# EAGLE design Fablab_RFID_conroller_V1 (EAGLE 7.5.0)
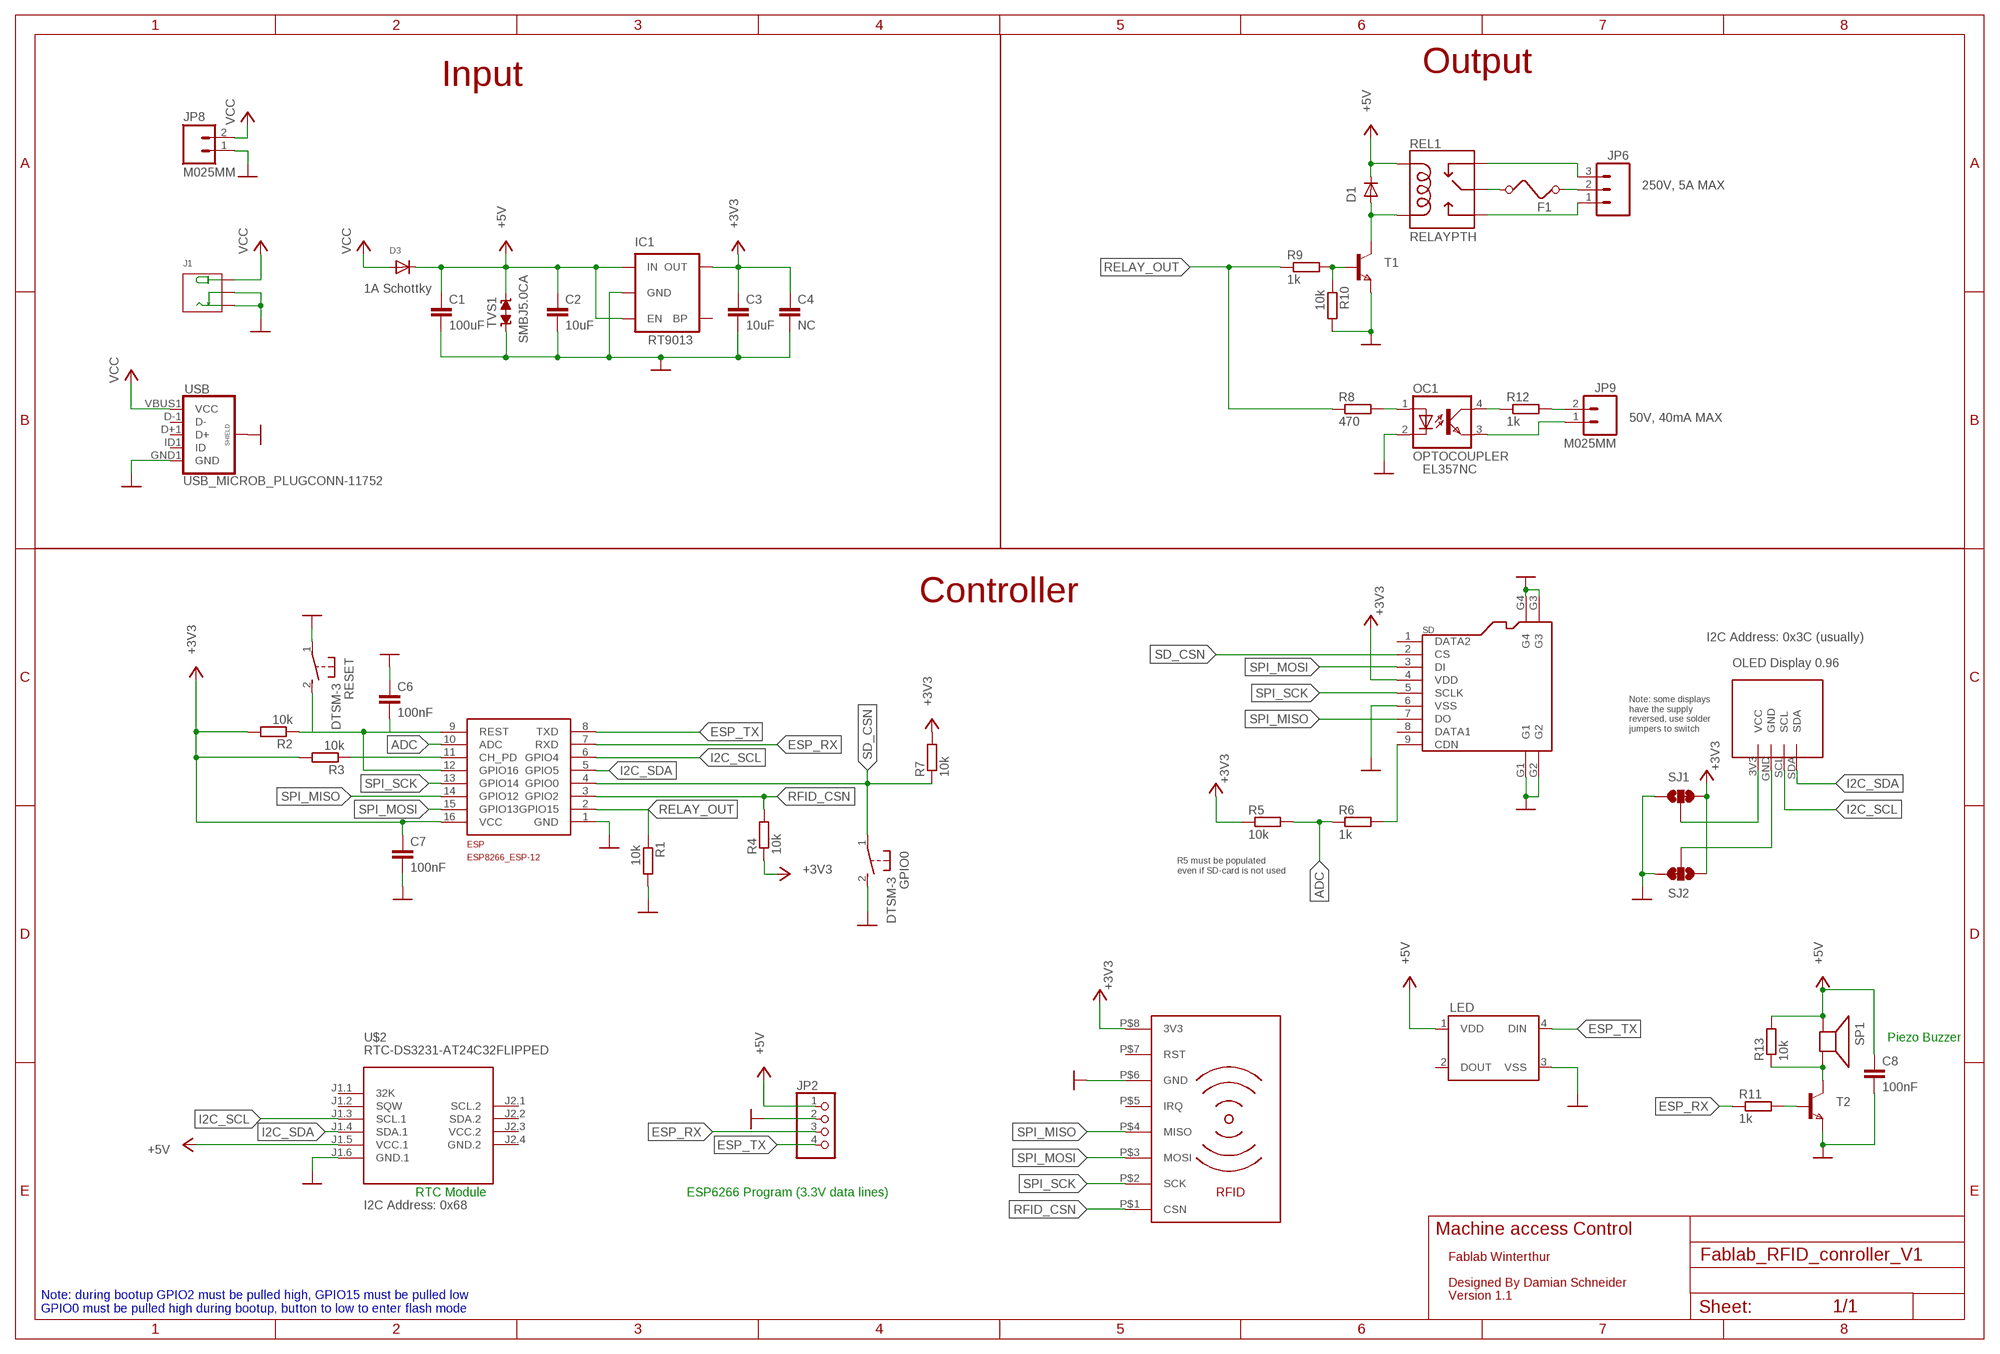
[diagram p0: schematic, sheet 1]

## Parts
C1  100uF  C-EUC1206  [C1206]
C2  10uF  C-EUC0805  [C0805]
C3  10uF  C-EUC0805  [C0805]
C4  NC  C-EUC1206  [C1206]
C6  100nF  C-EUC0603  [C0603]
C7  100nF  C-EUC0603  [C0603]
C8  100nF  C-EUC0603  [C0603]
D1  DIODE-MINIMELF  [MINIMELF]
D3  DIODESMA  [SMADIODE]
ESP  ESP8266_ESP-12  [ESP8266-ESP12]
F1  FUSE  [FUSE]
GPIO0  DTSM-3  [DTSM-3]
IC1  V_REG_LDOSMD  [SOT23-5]
J1  JACK-DC-3P-3410020P1  [PW-3P-2.1]
JP2  HEADER-1X476MIL  [1X04_ROUND_76]
JP6  M03-SCREW-5MM  [SCREWTERMINAL-5MM-3]
JP8  M025MM  [SCREWTERMINAL-5MM-2]
JP9  M025MM  [SCREWTERMINAL-5MM-2]
LED  WS2812B  [WS2812B]
OC1  OPTOCOUPLER  [SOP04]
OLED  OLED_0.96_I2CNOHOLES  [OLED_0.96_I2C_NOHOLES]
R1  10k  R-EU_R0603  [R0603]
R2  10k  R-EU_R0603  [R0603]
R3  10k  R-EU_R0603  [R0603]
R4  10k  R-EU_R0603  [R0603]
R5  10k  R-EU_R0603  [R0603]
R6  1k  R-EU_R0603  [R0603]
R7  10k  R-EU_R0603  [R0603]
R8  470  R-EU_R0603  [R0603]
R9  1k  R-EU_R0603  [R0603]
R10  10k  R-EU_R0603  [R0603]
R11  1k  R-EU_R0603  [R0603]
R12  1k  R-EU_R0805  [R0805]
R13  10k  R-EU_R0603  [R0603]
REL1  RELAYPTH  [SRD-05VDC-SL-C]
RESET  DTSM-3  [DTSM-3]
RFID  RFID_MODULE_RC522  [RFID-RC522-MODULE]
SD  MICRO-SDCARD-CONNECTOR-3300060P1  [9P-SMD-W-RING]
SJ1  JUMPER-PAD-3-2OF3_NC_BY_TRACE_LARGE  [PAD-JUMPER-3-2OF3_NC_BY_TRACE_YES_SILK_LARGE]
SJ2  JUMPER-PAD-3-2OF3_NC_BY_TRACE_LARGE  [PAD-JUMPER-3-2OF3_NC_BY_TRACE_YES_SILK_LARGE]
SP1  SPEAKER/AL60P  [AL60P]
T1  NPNSOT23  [SOT-23]
T2  NPNSOT23  [SOT-23]
TVS1  TVS-SMBJ  [SMBJ]
U$2  RTC-DS3231-AT24C32FLIPPED  [RTC-DS3231_FLIPPED]
USB  USB_MICROB_PLUGCONN-11752  [USB-B-MICRO-SMD_V03]

## Nets
!SDCARD_DETECT: R6.2 SD.9(CDN)
+3V3: C3.1 C4.1 C7.1 ESP.16(VCC) IC1.5(OUT) R2.2 R3.2 R4.1 R5.1 R7.2 RFID.P$8(3V3) SD.4(VDD) SJ1.3 SJ2.1
+5V: C1.1 C2.1 C8.1 D1.C D3.C IC1.1(IN) IC1.3(EN) JP2.1 LED.1(VDD) R13.2 REL1.COIL1 SP1.1(+) TVS1.C U$2.J1.5(VCC.1)
ADC: ESP.10(ADC) R5.2 R6.1
CHPD: ESP.11(CH_PD) R3.1
ESP_RX: ESP.7(RXD) JP2.3 R11.1
ESP_TX: ESP.8(TXD) JP2.4 LED.4(DIN)
GND: C1.2 C2.2 C3.2 C4.2 C6.1 C7.2 C8.2 ESP.1(GND) GPIO0.2 IC1.2(GND) J1.-1(-) J1.-2(CDN) JP2.2 JP8.1 LED.3(VSS) OC1.2(C) R1.2 R10.2 RESET.1 RFID.P$6(GND) SD.6(VSS) SD.G1 SD.G2 SD.G3 SD.G4 SJ1.1 SJ2.3 T1.2(E) T2.2(E) TVS1.A U$2.J1.6(GND.1) USB.GND1(GND) USB.SHIELD1(SHIELD) USB.SHIELD2(SHIELD) USB.SHIELD3(SHIELD)
I2C_SCL: ESP.6(GPIO4) OLED.SCL U$2.J1.3(SCL.1)
I2C_SDA: ESP.5(GPIO5) OLED.SDA U$2.J1.4(SDA.1)
N$1: JP9.2 R12.2
N$2: OLED.3V3(VCC) SJ1.2
N$3: OLED.GND SJ2.2
N$4: R9.2 R10.1 T1.3(B)
N$6: D1.A REL1.COIL0 T1.1(C)
N$8: R13.1 SP1.2(-) T2.1(C)
N$11: R11.2 T2.3(B)
N$12: F1.1 JP6.2
N$13: JP6.1 REL1.SW_NO(SWOPEN)
N$14: F1.2 REL1.SWCOMMON
N$15: JP6.3 REL1.SW_NC(SWCLOSE)
N$16: OC1.1(A) R8.2
N$17: OC1.4(COL) R12.1
N$18: JP9.1 OC1.3(EMIT)
RELAY_OUT: ESP.2(GPIO15) R1.1 R8.1 R9.1
RESET: C6.2 ESP.9(REST) ESP.12(GPIO16) R2.1 RESET.2
RFID_CSN: ESP.3(GPIO2) R4.2 RFID.P$1(CSN)
SD_CSN: ESP.4(GPIO0) GPIO0.1 R7.1 SD.2(CS)
SPI_MISO: ESP.14(GPIO12) RFID.P$4(MISO) SD.7(DO)
SPI_MOSI: ESP.15(GPIO13) RFID.P$3(MOSI) SD.3(DI)
SPI_SCK: ESP.13(GPIO14) RFID.P$2(SCK) SD.5(SCLK)
VCC: D3.A J1.+ JP8.2 USB.VBUS1(VCC)
Unconnected: IC1.4(BP) LED.2(DOUT) RFID.P$5(IRQ) RFID.P$7(RST) SD.1(DATA2) SD.8(DATA1) U$2.J1.1(32K) U$2.J1.2(SQW) U$2.J2.1(SCL.2) U$2.J2.2(SDA.2) USB.D+1(D+) USB.D-1(D-) USB.ID1(ID)

## Notes on the sheet
- Output
- Input
- 250V, 5A MAX
- 1A Schottky
- SMBJ5.0CA | RT9013
- 50V, 40mA MAX
- EL357NC
- Controller
- I2C Address: 0x3C (usually)
- OLED Display 0.96
- Note: some displays 
  have the supply 
  reversed, use solder
  jumpers to switch
- R5 must be populated
  even if SD-card is not used
- Piezo Buzzer
- RTC Module | ESP6266 Program (3.3V data lines)
- I2C Address: 0x68
- Machine access Control
- Fablab Winterthur
- Designed By Damian Schneider
- Version 1.1
- Note: during bootup GPIO2 must be pulled high, GPIO15 must be pulled low
  GPIO0 must be pulled high during bootup, button to low to enter flash mode

## Power pins joined to a net without a drawn wire
GND.2: U$2.J2.4(GND.2)
VCC.2: U$2.J2.3(VCC.2)

## Library data of the parts
C1-C4 C6-C8 = resistor:C-EU: CAPACITOR, European symbol
D1 = diode:DIODE-: DIODE
D3 = adafruit:DIODE: Diode SMADIODE - SMA Surface Mount Package 20V 1A Schottky Diode Digikey: 641-1014-6-ND DO-1N4148 - Through Hole Small Current Diode SOD-123 20V 1 A (.5mV Vf) Schottky Diode - Digikey: MBRX120TPMSCT-ND SOD-323 10V 570mA (.38mV Vf, 3ns) Schottky Diode - Digikey: ZLLS410CT-ND SOD-523 30V 30mA Schottky Diode (RB751S-40TE61) - Digikey: RB751S-40TE61CT-ND SOT23-R/W - SOT23 Package (R = Solder Paste/Reflow Ovens, W = Hand-Soldering) BAT54Film 40V 300mA - Digikey: 497-7162-1-ND
ESP = ESP8266-ESP12:ESP8266_ESP-12
F1 = special:FUSE: FUSE 5 x 20 mm
GPIO0 RESET = switch-mini-chinese-tact:DTSM-3
IC1 = SparkFun-PowerIC:V_REG_LDO: Voltage Regulator LDO Standard 150mA LDO voltage regulator in SOT-23 layout. Micrel part MIC5205. BP (by-pass) pin is used to lower output noise with 470pF cap.
J1 = OPL Eagle Library:JACK-DC-3P
JP2 = microbuilder:HEADER-1X4: PIN HEADER
JP6 = SparkFun-Connectors:M03: Header 3 Standard 3-pin 0.1" header. Use with straight break away headers (SKU : PRT-00116), right angle break away headers (PRT-00553), swiss pins (PRT-00743), machine pins (PRT-00117), and female headers (PRT-00115). Molex polarized connector foot print use with SKU : PRT-08232 with associated crimp pins and housings.; STOREFRONT_ID: PRT-08433
JP8 JP9 = smd_pinheader:M02: Standard 2-pin 0.1" header. Use with - straight break away headers ( PRT-00116) - right angle break away headers (PRT-00553) - swiss pins (PRT-00743) - machine pins (PRT-00117) - female headers (PRT-00115) Molex polarized connector foot print use with: PRT-08233 with associated crimp pins and housings. 2.54_SCREWTERM for use with PRT-10571. 3.5mm Screw Terminal footprints for PRT-08084 5mm Screw Terminal footprints for use with PRT-08432; STOREFRONT_ID: PRT-08432
LED = SparkFun-LED:WS2812B: WS2812B - Intelligent control LED integrated light source Technical Specifications: Power Supply Voltage (VDD): 3.5 to 5.3 V Input Voltage (VI): -0.5 to VDD+0.5 V Operating Junction Temperature (Topt): -25°C to +80°C Storage Temperature Range (Tstg): -55°C to +150°C
OC1 = SMDoptocoupler:OPTOCOUPLER
OLED = tft_1.8_1.44_oled_0.96:OLED_0.96_I2C
R1-R13 = resistor:R-EU_: RESISTOR, European symbol
REL1 = SRD-05VDC-SL-C:RELAY: SPDT relay (COM-00101)
RFID = RFID-RC522_module:RFID_MODULE_RC522
SD = OPL Eagle Library:MICRO-SDCARD-CONNECTOR: Micro SD Card
SJ1 SJ2 = SparkFun-Passives:JUMPER-PAD-3-2OF3_NC_BY_TRACE
SP1 = adafruit:SPEAKER: SPEAKER Source: Buerklin Added PS12 (for part # PS1240 piezo) http://www.ladyada.net/library/pcb/eaglelibrary.html
T1 T2 = zetex:NPNSOT23: NPN TRANSISTOR; MPN: DSS20201L-7; OC_FARNELL: 1710688; OC_NEWARK: 25R4555
TVS1 = supressor:TVS-: TVS BI-DIRECTIONAL
U$2 = diy-modules:RTC-DS3231-AT24C32: RTC Module with Battery and EEPROM based on DS3231 and AT24C32 chips Tutorial can be found here: https://edwardmallon.wordpress.com/2014/05/21/using-a-cheap-3-ds3231-rtc-at24c32-eeprom-from-ebay/ Click here to find device on ebay.com <http://www.ebay.com/sch/DS3231+AT24C32+module>
USB = Micro-USB-noname:USB_MICROB_PLUG: USB Micro-B connectors Some male, some female. Watch your step!; PROD_ID: CONN-11752

## Board
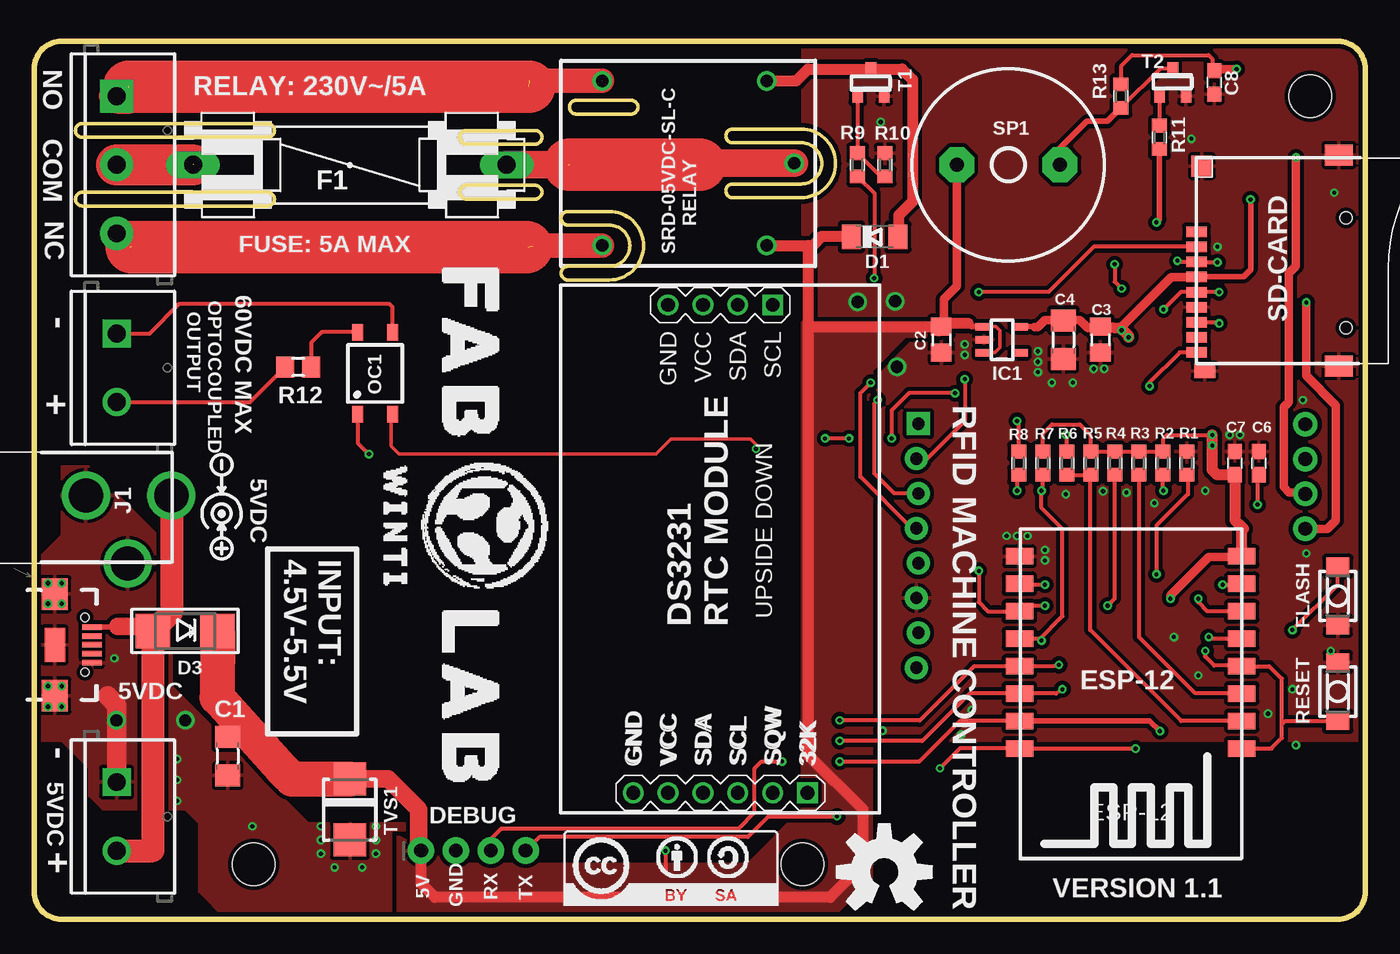
[diagram p1: board, top side]
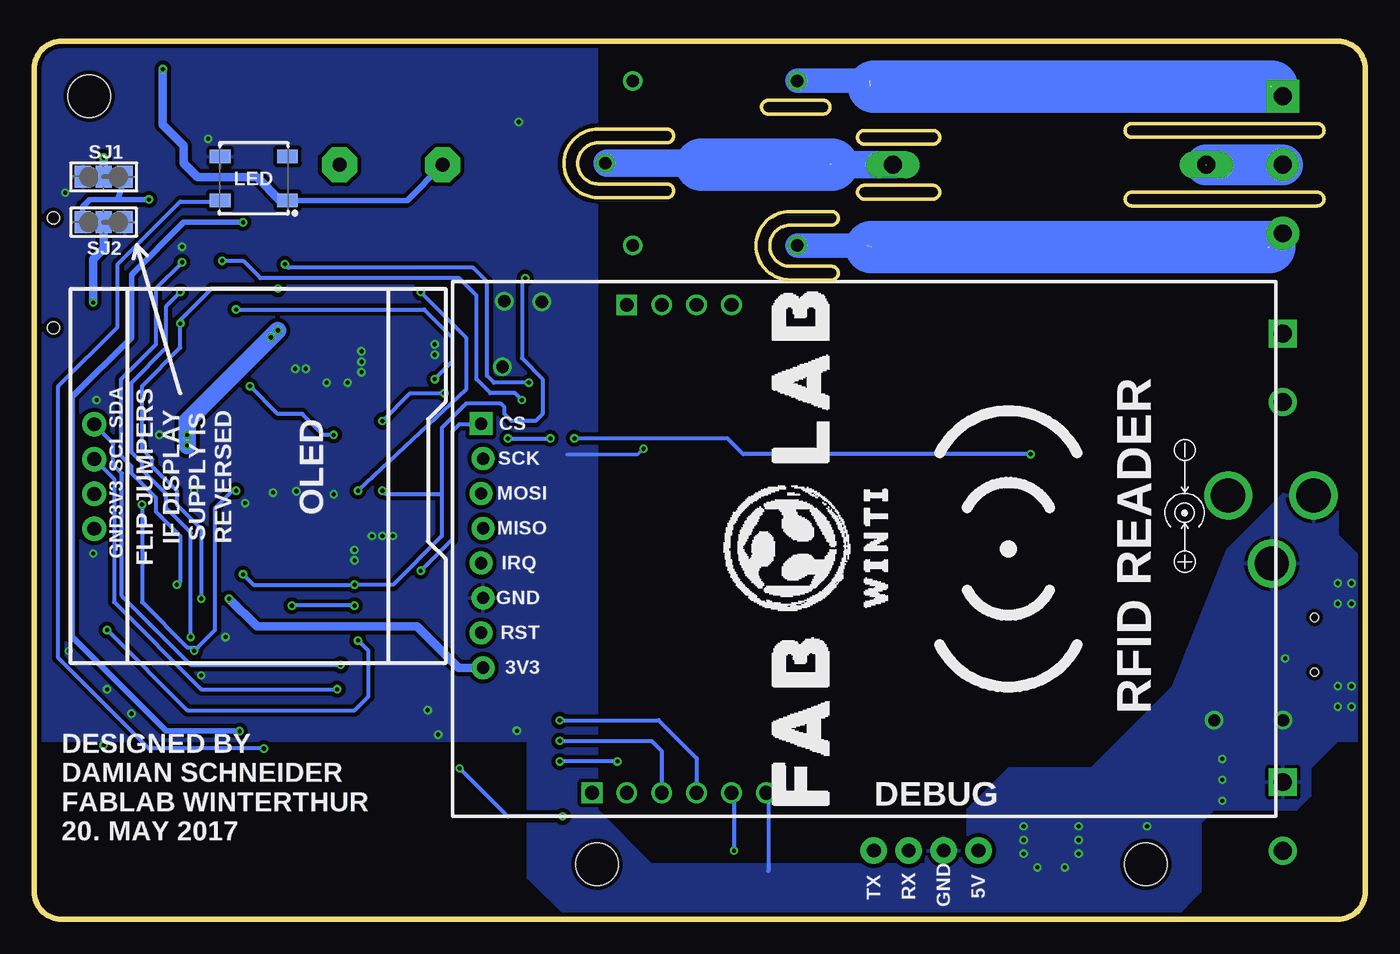
[diagram p2: board, bottom side, seen from below]

Size 97 x 64 mm. Coordinates in mm from the lower left corner, seen from the top.
Outline: 95,0 2,0 arc-90 0,2 0,62 arc-90 2,64 95,64 arc-90 97,62 97,2 arc-90 95,0
Outline: 17.5,57.5 arc-90 17,57 3.5,57 arc-90 3,57.5 arc-90 3.5,58 17,58 arc-90 17.5,57.5
Outline: 17.5,52.5 arc-90 17,52 3.5,52 arc-90 3,52.5 arc-90 3.5,53 17,53 arc-90 17.5,52.5
Outline: 37,57 arc-90 36.5,56.5 31.5,56.5 arc-90 31,57 arc-90 31.5,57.5 36.5,57.5 arc-90 37,57
Outline: 37,53 arc-90 36.5,52.5 31.5,52.5 arc-90 31,53 arc-90 31.5,53.5 36.5,53.5 arc-90 37,53
Outline: 50.4,57.1 arc90 50.9,56.6 55.9,56.6 arc-90 57.4,55.1 arc-90 55.9,53.6 50.9,53.6 arc90 50.4,53.1 arc90 50.9,52.6 55.9,52.6 arc90 58.4,55.1 arc90 55.9,57.6 50.9,57.6 arc90 50.4,57.1
Outline: 44,59.2 arc-90 43.5,58.7 39.5,58.7 arc-90 39,59.2 arc-90 39.5,59.7 43.5,59.7 arc-90 44,59.2
Outline: 38.4,51.1 arc90 38.9,50.6 41.9,50.6 arc-90 43.4,49.1 arc-90 41.9,47.6 38.9,47.6 arc90 38.4,47.1 arc90 38.9,46.6 41.9,46.6 arc90 44.4,49.1 arc90 41.9,51.6 38.9,51.6 arc90 38.4,51.1
Copper layers (1*16): Top 0.035mm / dielectric 1.5mm / Bottom 0.035mm
Design rules "dirt_cheap_dirty_boards.v1 *": minimum track width 8mil, minimum drill 12mil, track to track 8mil, track to pad 8mil, pad to pad 8mil, via to via 8mil, smd to smd 0mil, copper to edge 12mil, drill to drill 12mil, minimum pad ring 10mil, minimum via ring 6mil, stop-mask expansion 2mil, vias tented up to drill 25mil, thermal gap 10mil
Holes 3.1 mm at 93,60 16,4 56,4

### Footprints (pad centres in the part's own frame; a part is rotated, then mirrored left to right if it is on the bottom)
C1206 = smd 1.6 x 1.8: 1 -1.4,0; 2 1.4,0
C0805 = smd 1.3 x 1.5: 1 -0.95,0; 2 0.95,0
C0603 = smd 1.1 x 1: 1 -0.85,0; 2 0.85,0
MINIMELF = smd 1.4 x 1.8: A 1.7,0; C -1.7,0
SMADIODE = smd 2.54 x 2.54: A 2.349,0; C -2.349,0
ESP8266-ESP12 = smd 2 x 1.2: 1 16.2,2; 2 16.2,4; 3 16.2,6; 4 16.2,8; 5 16.2,10; 6 16.2,12; 7 16.2,14; 8 16.2,16; 9 0,16; 10 0,14; 11 0,12; 12 0,10; 13 0,8; 14 0,6; 15 0,4; 16 0,2
FUSE = drill 1.321 long: 1 -11.43,0; 2 11.43,0
DTSM-3 = smd 1.3 x 1.7: 1 -2.15,0; 2 2.15,0
SOT23-5 = smd 0.55 x 1.2: 1 -0.95,-1.3; 2 0,-1.3; 3 0.95,-1.3; 4 0.95,1.3; 5 -0.95,1.3
PW-3P-2.1 = drill 2.5: + 6.985,0.889; -1 0.762,0.889; -2 3.81,-4.064
1X04_ROUND_76 = drill 1 pad 1.93: 1 -3.81,0; 2 -1.27,0; 3 1.27,0; 4 3.81,0
SCREWTERMINAL-5MM-3 = drill 1.3 pad 2.413 square: 1 0,0 | drill 1.3 pad 2.413: 2 5,0; 3 10,0
SCREWTERMINAL-5MM-2 = drill 1.3 pad 2.032 square: 1 0,0 | drill 1.3 pad 2.032: 2 5,0
WS2812B = smd 1.5 x 1: 1 -2.45,1.6; 2 -2.45,-1.6; 3 2.45,-1.6; 4 2.45,1.6
SOP04 = smd 0.8 x 1.2: 1 -1.27,-3; 2 1.27,-3; 3 1.27,3; 4 -1.27,3
OLED_0.96_I2C_NOHOLES = drill 1 pad 1.778: 3V3 -0.995,11.63; GND -3.535,11.63; SCL 1.545,11.63; SDA 4.085,11.63
R0603 = smd 1 x 1.1: 1 -0.85,0; 2 0.85,0
R0805 = smd 1.3 x 1.5: 1 -0.95,0; 2 0.95,0
SRD-05VDC-SL-C = drill 0.9: COIL0 -5.39,-6.12; COIL1 -5.39,5.88; SW_NC 6.61,5.88; SW_NO 6.61,-6.12; SWCOMMON -7.39,-0.12
RFID-RC522-MODULE = drill 0.9 pad 1.676 square: P$1 9.12,28.44 | drill 0.9 pad 1.676: P$2 6.58,28.29; P$3 4.04,28.44; P$4 1.5,28.29; P$5 -1.04,28.44; P$6 -3.58,28.29; P$7 -6.12,28.44; P$8 -8.66,28.29
9P-SMD-W-RING = smd 1.524 x 0.762: 1 -7.493,2.114; 2 -7.493,1.014; 3 -7.493,-0.086; 4 -7.493,-1.186; 5 -7.493,-2.286; 6 -7.493,-3.386; 7 -7.493,-4.486; 8 -7.493,-5.586; 9 -7.493,-6.686 | smd 1.524 x 1.016: G1 -6.893,-8.032 | smd 2.032 x 1.524: G2 2.88,-7.686; G3 2.88,7.714 | smd 1.524 x 1.524: G4 -7.101,6.895 | hole 0.889: 3.407,-4.886; 3.407,3.114
PAD-JUMPER-3-2OF3_NC_BY_TRACE_YES_SILK_LARGE = smd 1.168 x 1.6: 1 -1.524,0; 2 0,0; 3 1.524,0
AL60P = drill 1.016 pad 2.54 octagon: 1 -3.759,0; 2 3.759,0
SOT-23 = smd 0.787 x 0.889: 1 0.025,-1.016; 2 -0.94,1.016; 3 0.991,1.016
SMBJ = smd 2.4 x 2.4: A 2.223,0; C -2.223,0
RTC-DS3231_FLIPPED = drill 1 square: J1.1 -17.78,-6.35; J2.1 17.78,-3.81 | drill 1: J1.2 -17.78,-3.81; J1.3 -17.78,-1.27; J1.4 -17.78,1.27; J1.5 -17.78,3.81; J1.6 -17.78,6.35; J2.2 17.78,-1.27; J2.3 17.78,1.27; J2.4 17.78,3.81
USB-B-MICRO-SMD_V03 = smd 1.4 x 0.4: D+1 2.7,0; D-1 2.7,0.65; GND1 2.7,-1.3; ID1 2.7,-0.65; VBUS1 2.7,1.3 | smd 1.9 x 2.3: SHIELD1 0,3.7; SHIELD2 0,-3.7 | smd 1.5 x 2.5: SHIELD3 0,0 | hole 0.6: 2.2,2; 2.2,-2

### Placement (x,y rotation side)
C1  14.09,11.88 270 top
C2  66.1,42.25 270 top
C3  77.7,42.25 270 top
C4  75,42.25 270 top
C6  89.25,33.25 270 top
C7  87.5,33.25 90 top
C8  86,61 270 top
D1  61.25,49.75 0 top
D3  11,21 180 top
ESP  88,28.45 180 top
F1  23,55 0 top
GPIO0  95,23.57 270 top
IC1  70.5,42.25 270 top
J1  3,30 0 top
JP2  32,5 0 top
JP6  6,60 270 top
JP8  6,10 270 top
JP9  6,42.7 270 top
LED  81,54 180 bottom
OC1  24.84,39.79 0 top
OLED  81,32 90 bottom
R1  84,33.25 90 top
R2  82.25,33.25 90 top
R3  80.5,33.25 90 top
R4  78.75,33.25 270 top
R5  77,33.25 270 top
R6  75.25,33.25 90 top
R7  73.5,33.25 90 top
R8  71.75,33.25 90 top
R9  60,55 90 top
R10  62,55 90 top
R11  82,57 90 top
R12  19.22,40.25 180 top
R13  79.2,60 90 top
REL1  48,55 180 top
RESET  95,16.59 270 top
RFID  36,27 90 bottom
SD  92.2,48 0 top
SJ1  91.95,54.12 0 bottom
SJ2  91.95,50.82 0 bottom
SP1  71,55 0 top
T1  61,61 180 top
T2  83,61 180 top
TVS1  23,8 270 top
U$2  50,27 90 top
U$6  [OSHW-LOGO-L]  61.95,3.45 0 top
USB  1.5,20 0 top

### Tracks (layer width: path | path; a pad name or v marks a point on that pad's centre or on a via)
!SDCARD_DETECT  (via drill 0.3)
  Top 0.305: R6.2 75.25,35.24 v75.18,35.31 | v81.28,38.86 81.28,39.12 83.48,41.31 SD.9
  Bottom 0.305: v75.18,35.31 75.95,35.31 77.47,36.83 79.25,36.83 v81.28,38.86
+3V3  (via drill 0.3)
  Top 0.305: v79.25,42.93 79.3,42.97 | R7.2 73.5,35.4 74.17,36.07 76.2,36.07 76.96,35.31 76.96,34.14 R5.1 R4.1 R3.2 R2.2 82.3,34.15 82.3,35.05 82.55,35.31 v85.85,35.31
  Top 0.406: IC1.5 72.88,43.2 72.9,43.18 | v88.65,52.47 88.65,47.37 88.14,46.86 84.76,46.86 SD.4
  Top 0.61: 72.9,43.18 73.15,43.18 73.66,43.69 74.96,43.69 C4.1 75.04,43.69 76.2,43.69 76.79,43.1 C3.1 | 79.17,43.1 82.88,46.81 SD.4 | v82.8,23.37 82.8,23.62 85.6,26.42 87.97,26.42 ESP.16
  Top 0.813: C3.1 79.17,43.1 79.3,42.97 79.76,42.51 v79.76,42.42 | ESP.16 88,28.59 | 88,28.59 87.5,29.09 C7.1 86.22,32.4 85.85,32.77 v85.85,34.54 v85.85,35.31 | 88.12,28.46 88,28.59
  Bottom 0.406: SJ1.3 90.42,53.98 90.93,52.47 | 90.93,52.47 92.96,52.47 93.47,51.96 SJ2.1 | 90.93,52.47 v88.65,52.47
  Bottom 0.61: RFID.P$8 66.09,18.34 69.09,21.34 80.77,21.34 v82.8,23.37
  Bottom 0.813: v85.85,34.54 v85.85,35.31
  Bottom 1.27: v79.25,42.93 85.85,36.32 v85.85,34.54
+5V  (via drill 0.3)
  Top 0.203: 66.43,43.43 66.29,43.29 | C1.1 18.09,10.09 18.5,10.5
  Top 0.254: IC1.1 70.08,43.2 70.36,42.93 70.36,41.66 70,41.3 IC1.3
  Top 0.305: C8.1 85.85,62 85.85,62.74 85.6,62.99 80.01,62.99 79.2,62.18 R13.2 | v46,5 46,3.5
  Top 0.406: IC1.1 68.31,43.2 68.07,43.43
  Top 0.61: SP1.1 67.24,46.16 66.29,45.21 66.29,43.29 | v87.63,61.98 86.13,61.98 C8.1
  Top 0.813: 68.07,43.43 66.43,43.43 C2.1 56.4,43.2 | REL1.COIL1 56.4,49.12 | 56.4,49.12 56.74,49.12 57.4,49.78 59.52,49.78 D1.C | 56.4,49.12 56.4,43.2 | 56.4,43.2 56.4,12 60.4,8 60.4,4 58,1.6 29.2,1.6 28.19,2.61 JP2.1
  Top 1.016: 18.07,10 16,12.8 16,13.28 C1.1 | 22.78,10 TVS1.C | 65.9,43 C2.1
  Top 1.27: TVS1.C 25.78,10.22 28,8 28,5.19 JP2.1
  Top 2.54: D3.C 13.33,16.17 18,11 18.5,10.5 18.78,10.22 TVS1.C
  Bottom 0.305: U$2.J1.5 46,9.03 v46,5
  Bottom 0.406: LED.1 69.84,52.4 SP1.1
  Bottom 0.61: LED.1 79.07,52.4 80.77,54.1 85.09,54.1 86.11,55.12 86.11,56.39 87.63,57.91 v87.63,61.98
  pour Top (isolate 0.3): 66,43.5 56,43.5 56,8 52,4 30.5,4 26.5,6 26.5,0 58,0 61,3 61,40 63.5,42.5 65,42.5
ADC
  Top 0.305: R6.1 R5.2 76.96,32.36 76.96,21.08 83.59,14.45 ESP.10
CHPD
  Top 0.305: R3.1 80.52,32.38 80.52,20.57 84.58,16.51 87.94,16.51 ESP.11
ESP_RX  (via drill 0.3)
  Top 0.305: ESP.7 67.45,14.45 64.5,11.5 v58.7,11.5 | JP2.3 33.27,5.84 34.04,6.6 51.31,6.6 52.5,7.8 52.5,11 53,11.5 v54.5,11.5
  Top 0.406: ESP.7 71.83,14.48 81.28,14.48 v82.04,13.72 | v81.79,50.8 82,51.01 R11.1
  Bottom 0.305: v54.5,11.5 v58.7,11.5
  Bottom 0.406: v82.04,13.72 87.38,13.72 94.23,20.57 94.23,38.1 89.92,42.42 89.92,46.99 86.11,50.8 v81.79,50.8
ESP_TX  (via drill 0.3)
  Top 0.305: v80.26,12.45 ESP.8 67.45,12.45 v66,11 | JP2.4 36.81,6 52,6 53.5,7.5 v58.5,7.5
  Bottom 0.305: v80.26,12.45 88.65,12.45 95.25,19.05 95.25,38.86 90.93,43.18 90.93,47.75 86.36,52.32 83.53,52.32 LED.4 | v58.5,7.5 62.5,7.5 v66,11
GND  (via drill 0.3, 0.9)
  Top 0.254: OC1.2 26,36.5 26,34.5 26.6,33.9 45.3,33.9 46.4,35 52.2,35 52.6,34.6 v52.6,34.3
  Top 1.422: JP8.1 6,15.61 5.33,16.27
  Bottom 0.254: v52.6,34.3 53.04,33.86 58.18,33.86
  Bottom 0.305: U$2.J1.6 43.5,9.07 43.5,3.5
  other vias: 5.83,19.02 67.82,41.91 67.82,41.15 73.15,41.4 73.15,40.64 73.15,39.88 77.98,40.13 77.22,40.13 75.69,39.12 75.18,30.99 74.17,39.12 84.33,56.9 73.66,26.92 71.63,27.94 73.66,26.16 72.39,27.94 70.87,27.94 85.34,31.24 91.95,12.7 87.12,35.31 87.88,35.31 24.89,6.78 10.41,11.68 10.41,8.64 10.41,10.16 89.92,14.99 94.49,19.56 84.84,17.78 77.9,31.2 79.6,31.1 81.63,30.34 83.06,20.57 67.56,13.46 68.33,15.24 92.46,37.85 91.69,16.76 92.71,26.67 86.23,49.02 94.74,52.97 61.69,58.12 2,17 1,17 1,23 2,23 2,24.5 1,24.5 1,15.5 2,15.5 11,14.5 6,14.5 61.83,13.74 60,45 62.74,45.06 62.87,40.27 20.89,6.78 20.89,5.78 20.89,4.78 24.89,5.78 24.89,4.78 21.89,3.78 23.89,3.78 15.89,6.78
  pour Bottom (isolate 0.3): 56,13 97,13 97,64 56,64
  pour Top (isolate 0.3, rank 2): 56,64 56,13 97,13 97,64
  pour Top (isolate 0.3, rank 2): 2,33 2,28 0,26 0,13 2,13 4,11 4,9 5,8 11,8 12,7 12,2 14,0 27,0 27,7 20,7 10,17 10,27 4,33
  pour Bottom (isolate 0.3): 0,26 2,28 2,30 3,31 6,31 10,27 14,17 20,11 26,11 29,8 29,0 14,0 12,2 12,7 11,8 5,8 4,9 4,11 2,13 0,13
  pour Bottom (isolate 0.3): 26.5,6 31,6 32,5 32,4 52,4 56,8 56,14 61,14 61,3 58,0 26.5,0
I2C_SCL  (via drill 0.3)
  Top 0.305: v74.93,16.76 74.48,16.45 ESP.6 68.17,16.45 64.72,13 v58.7,13
  Bottom 0.305: v74.93,16.76 84.84,16.76 91.19,23.11 91.19,32.1 OLED.SCL | v58.7,13 52,13 51.27,12.27 U$2.J1.3
I2C_SDA  (via drill 0.3)
  Top 0.305: v74.68,18.54 74.33,18.45 ESP.5 68.49,18.45 64.52,14.48 64.49,14.5 v58.7,14.5
  Bottom 0.305: v74.68,18.54 85.6,18.54 90.63,23.57 90.63,32.51 91.24,33.12 91.24,34.69 OLED.SDA | v58.7,14.5 51.5,14.5 48.73,11.73 U$2.J1.4
N$1
  Top 0.305: JP9.2 15.72,37.7 R12.2
N$2  (via drill 0.3)
  Top 0.61: v91.95,55.52 91.95,47.62 91.44,47.12 91.44,37.72 91.06,37.34 91.06,31.5 91.44,31.11 92.52,31.11 OLED.3V3
  Bottom 0.61: SJ1.2 v91.95,55.52
N$3  (via drill 0.3)
  Top 0.61: v92.71,44.96 92.71,39.62 94.87,37.47 94.87,29.08 94.23,28.45 92.65,28.45 OLED.GND
  Bottom 0.61: SJ2.2 91.95,48.9 92.71,48.13 v92.71,44.96
N$4
  Top 0.305: T1.3 R9.2 61.7,54.15 R10.1
N$6
  Top 0.813: REL1.COIL0 55.53,61.12 56.39,61.98 60.94,61.98 | 60.94,61.98 T1.1 | 60.94,61.98 63.25,61.98 64.01,61.21 64.01,52.32 62.99,51.31 62.99,49.79 D1.A
N$8
  Top 0.305: T2.1 82.07,62.02 R13.1
  Top 0.406: SP1.2 74.76,56.22 76.71,58.17 78.22,58.17 R13.1 79.22,59.15
N$11
  Top 0.305: T2.3 R11.2
N$12  (1 unrouted)
  Top 3: JP6.2 F1.1
  Bottom 3: 11.6,55 6.03,55
N$13  (3 unrouted)
  Top 1.8: REL1.SW_NO 36.88,61.12
  Top 2.54: JP6.1 7,60 6.9,60.7
  Top 3.81: 6.9,60.7 36.05,60.7
  Bottom 1.8: 36.11,61.12 REL1.SW_NO
  Bottom 3.81: 35.8,60.7 6.8,60.7
N$14  (1 unrouted)
  Top 2: REL1.SWCOMMON 55.26,55.12 49,55.12 | 39,55 F1.2
  Top 2.184: 49,55.12 48.5,55
  Top 3.81: 48.5,55 39,55
  Bottom 0.406: 55.26,55.12 REL1.SWCOMMON
  Bottom 2: 34.32,55 38.86,55 | 48.87,55.12 55.26,55.12
  Bottom 2.3: 38.86,55 38.89,55
  Bottom 3.81: 38.86,55 48.36,55
N$15  (2 unrouted)
  Top 0.406: 41.39,49 REL1.SW_NC
  Top 1.8: REL1.SW_NC 37.25,49.12
  Top 2.184: JP6.3 7.1,49
  Top 3.81: 7.1,49 35.88,49
  Bottom 0.406: REL1.SW_NC 41,49.12
  Bottom 1.8: 36.36,49.12 41,49.12 REL1.SW_NC
  Bottom 3.81: 36,49 7,49
N$16  (via drill 0.3)
  Top 0.305: R8.2 71.75,36.2 v71.63,36.32 | v62.48,35.05 62.48,37.08 63.75,38.35 v67.11,38.35 | v59.38,35.05 v57.63,35.05 | OC1.1 23.57,34.72 v24.38,33.91
  Bottom 0.305: v62.48,35.05 v59.38,35.05 | v71.63,36.32 69.6,38.35 v67.11,38.35 | v24.38,33.91 45.34,33.91 46.48,35.05 v57.63,35.05
N$17
  Top 0.305: OC1.4 20.95,42.79 20.19,42.04 20.19,40.27 R12.1
N$18
  Top 0.305: OC1.3 26.11,44.63 25.91,44.83 10.54,44.83 8.38,42.67 6.03,42.67 JP9.1
RELAY_OUT  (via drill 0.3)
  Top 0.305: 71.73,24.38 ESP.2 71.87,24.38 v73.66,24.38 | R9.1 61.21,52.94 v61.21,46.74 | R1.1 84.07,32.4 84.07,30.99 81.79,28.7 v81.79,25.15 | R8.1 71.63,32.28 v71.63,31.24
  Bottom 0.305: v61.21,46.74 61.47,46.48 61.47,40.89 59.94,39.37 59.94,36.83 60.45,36.32 62.23,36.32 62.74,36.83 62.74,37.34 62.99,37.59 65.53,37.59 67.31,35.81 67.31,30.99 | v81.79,25.15 81.03,24.38 v73.66,24.38 70.87,24.38 67.31,27.94 67.31,30.99 | v71.63,31.24 71.37,30.99 67.31,30.99
RESET  (via drill 0.3)
  Top 0.305: ESP.9 90.17,12.45 | 90.17,12.45 90.93,13.21 90.93,14.22 | 90.93,14.22 90.93,17.53 90.01,18.45 ESP.12 87.95,18.5 86,18.5 85.34,19.16 v85.34,19.56 | 90.17,12.45 | C6.2 89.15,32.3 v89.15,30.23 | v82.3,31.24 82.25,31.29 R2.1 | RESET.2 91.15,14.44 90.93,14.22
  Bottom 0.305: v89.15,30.23 89.15,23.11 85.85,19.81 85.34,19.81 | 85.34,19.81 85.09,19.81 83.82,21.08 83.82,29.97 82.55,31.24 v82.3,31.24 | v85.34,19.56 85.34,19.81
RFID_CSN  (via drill 0.3)
  Top 0.305: v73.66,22.86 72.21,22.86 ESP.3 69.5,22.45 68.83,23.11 v68.83,25.4 | v78.23,22.86 78.75,23.38 R4.2
  Bottom 0.305: v73.66,22.86 v78.23,22.86 | RFID.P$1 64.49,36.07 66.04,36.07 66.55,35.56 66.55,27.69 v68.83,25.4
SD_CSN  (via drill 0.3)
  Top 0.305: v73.41,20.32 73.28,20.45 | 73.28,20.45 ESP.4 | 73.28,20.45 74.93,22.1 74.93,28.45 73.41,29.97 v73.41,31.24 73.5,31.34 R7.1 | SD.2 84.7,49.02 77.22,49.02 73.91,45.72 v68.83,45.72 | v91.69,21.08 95,24.38 GPIO0.1
  Bottom 0.305: v91.69,21.08 85.85,15.24 73.66,15.24 72.64,16.26 72.64,19.56 v73.41,20.32 | v68.83,45.72 65.53,42.42 65.53,38.61 v73.41,31.24
SPI_MISO  (via drill 0.3)
  Top 0.305: SD.7 86.28,43.51 v86.36,43.43 | v84.84,23.37 84.84,23.11 85.5,22.45 ESP.14 | RFID.P$4 63.96,28.5 60.2,32.26 60.2,38.35 v60.96,39.12 | v78.74,47.75 78.74,46.48 v79.25,45.97
  Bottom 0.305: v84.84,23.37 84.84,28.45 86.61,30.23 86.61,31.24 88.39,33.02 88.39,33.53 89.15,34.29 89.15,38.86 86.36,41.66 v86.36,43.43 86.36,43.69 84.07,45.97 v79.25,45.97 | v60.96,39.12 63.5,39.12 64.01,39.62 64.01,46.48 65.02,47.5 78.49,47.5 v78.74,47.75
SPI_MOSI  (via drill 0.3)
  Top 0.305: v86.23,47.88 86.2,47.91 SD.3 83.4,47.91 v83.31,48.01 | v86.61,24.38 87.93,24.38 ESP.15 | RFID.P$3 62.69,31.04 61.21,32.51 61.21,37.59 v61.47,37.85
  Bottom 0.305: v86.23,47.88 88.14,45.97 88.14,41.91 90.68,39.37 90.68,33.78 89.92,33.02 89.92,32.51 88.14,30.73 88.14,29.72 86.36,27.94 86.36,24.64 v86.61,24.38 | v61.47,37.85 61.98,38.35 63.75,38.35 64.77,39.37 64.77,45.47 66.04,46.74 80.52,46.74 81.79,48.01 v83.31,48.01
SPI_SCK  (via drill 0.3)
  Top 0.305: v82.3,44.45 83.56,45.71 SD.5 v86.36,45.72 | ESP.13 85.72,20.45 v85.6,20.57 | v67.82,39.37 67.82,36.32 65.08,33.58 RFID.P$2
  Bottom 0.305: v85.6,20.57 85.6,28.19 87.38,29.97 87.38,30.99 89.15,32.77 89.15,33.27 89.92,34.04 89.92,39.12 87.38,41.66 87.38,44.7 v86.36,45.72 | v82.3,44.45 68.58,44.45 66.55,42.42 66.55,40.64 v67.82,39.37
VCC
  Top 0.406: USB.VBUS1 6.06,21.3 6.1,21.34
  Top 1.27: 6.1,21.34 8.31,21.34 D3.A
  Top 1.676: JP8.2 8.65,5 D3.A 10,22.35 10,30.89 J1.+

### Text on the board
tNames: NO | RELAY: 230V~/5A | COM | NC | FUSE: 5A MAX | SRD-05VDC-SL-C / RELAY | 60VDC MAX | OPTOCOUPLED / OUTPUT | - | SD-CARD | RFID MACHINE CONTROLLER | + | 5VDC | INPUT: / 4.5V-5.5V | DS3231 / RTC MODULE | FLASH | ESP-12 | 5VDC | RESET | - | GND | VCC | SDA | SCL | SQW | 32K | 5VDC | DEBUG | + | 5V | VERSION 1.1 | GND | RX | TX
bNames: FLIP JUMPERS / IF DISPLAY / SUPPLY IS / REVERSED | DEBUG | DESIGNED BY / DAMIAN SCHNEIDER / FABLAB WINTERTHUR / 20. MAY 2017 | 5V | GND | RX | TX